# Altium project fm_transmitter.PrjPcb
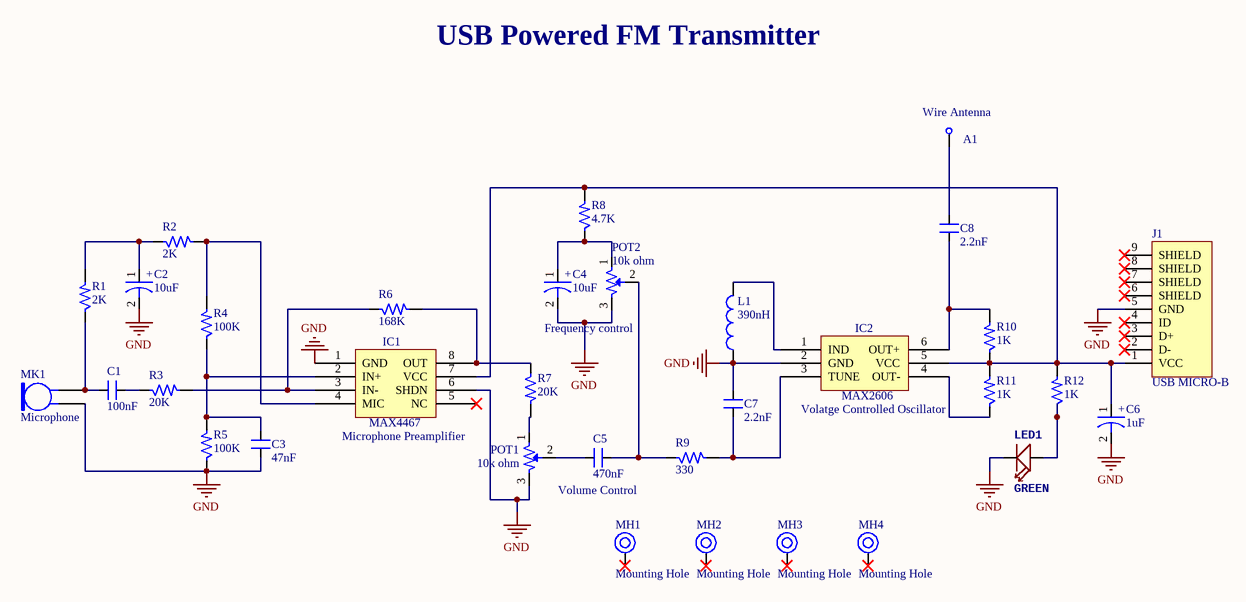
[diagram p0: fm_transmitter.SchDoc]
1 sheet, 33 parts. Net scope: global (net labels, ports and power ports of the same name join across sheets).
Board file: fm_transmitter.PcbDoc

## Sheet fm_transmitter.SchDoc
size A4; PageSetup: Record=PageOptions¦CenterHorizontal=False¦CenterVertical=False¦PrintScale=0.95¦XCorrection=0.00¦YCorrection=0.00¦PrintKind=1¦BorderSize=5000000¦LeftOffset=0¦BottomOffset=0¦Orientation=1¦PaperLength=1000¦PaperWidth=1000¦Scale=100¦PaperSource=15¦PrintQuality=600¦MediaType=1¦DitherType=10¦PaperKind=A4¦PrintScaleMode=1; ProcessInspection: Ò.êîíòð.; NormInspection: Í.êîíòð.; Letter1Column: {}; Letter2Column: {}; Letter3Column: {}; AgreedBy: Ñîãëàñîâàë

### Parts
A1  Wire Antenna  [TEST POINT_78]
C1  100nF  [CAP_0805]
C2  10uF  [ACAP_P339_D393_H531_RAD]
C3  47nF  [CAP_0805]
C4  10uF  [ACAP_P339_D393_H531_RAD]
C5  470nF  [CAP_0805]
C6  1uF  [ACAP_P339_D393_H531_RAD]
C7  2.2nF  [CAP_0805]
C8  2.2nF  [CAP_0805]
IC1  MAX4467  [TI SOT-23-8 DDF]
IC2  MAX2606  [MAXIM SOT-23-6]
J1  USB MICRO-B  [CON_10118192-0001LF_SMD]
L1  390nH  [IND_0805]
LED1  GREEN  [LED-0603]
MH1  Mounting Hole  [MOUNTING]
MH2  Mounting Hole  [MOUNTING]
MH3  Mounting Hole  [MOUNTING]
MH4  Mounting Hole  [MOUNTING]
MK1  Microphone  [PIN2]
POT1  10k ohm  [POT_3361P_SMD]
POT2  10k ohm  [POT_3361P_SMD]
R1  2K  [RES_0805]
R2  2K  [RES_0805]
R3  20K  [RES_0805]
R4  100K  [RES_0805]
R5  100K  [RES_0805]
R6  168K  [RES_0805]
R7  20K  [RES_0805]
R8  4.7K  [RES_0805]
R9  330  [RES_0805]
R10  1K  [RES_0805]
R11  1K  [RES_0805]
R12  1K  [RES_0805]

### Nets
GND: C2.2 C3.1 C4.2 C6.2 C7.2 IC1.1(GND) IC1.6(SHDN) IC2.2(GND) J1.5(GND) L1.1 LED1.- MK1.1 POT1.3 POT2.3 R5.1
NetA1_1: A1.1 C8.2
NetC1_1: C1.1 MK1.2 R1.1
NetC1_2: C1.2 R3.1
NetC2_1: C2.1 R1.2 R2.1
NetC3_2: C3.2 IC1.2(IN+) R4.1 R5.2
NetC4_1: C4.1 POT2.1 R8.1
NetC5_1: C5.1 POT1.2
NetC5_2: C5.2 POT2.2 R9.1
NetC6_1: C6.1 IC1.7(VCC) IC2.5(VCC) J1.1(VCC) R8.2 R10.1 R11.2 R12.2
NetC7_1: C7.1 IC2.3(TUNE) R9.2
NetC8_1: C8.1 IC2.6(OUT+) R10.2
NetIC1_3: IC1.3(IN-) R3.2 R6.1
NetIC1_4: IC1.4(MIC) R2.2 R4.2
NetIC1_8: IC1.8(OUT) R6.2 R7.1
NetIC2_1: IC2.1(IND) L1.2
NetIC2_4: IC2.4(OUT-) R11.1
NetLED1_+: LED1.+ R12.1
NetPOT1_1: POT1.1 R7.2

Not connected (* = marked no-connect by the designer): IC1 5(NC)*; J1 2(D-)* 3(D+)* 4(ID)* 6(SHIELD)* 7(SHIELD)* 8(SHIELD)* 9(SHIELD)*; MH1 1*; MH2 1*; MH3 1*; MH4 1*

### Notes on the sheet
- USB Powered FM Transmitter
- Frequency control
- (near R11) Volatge Controlled Oscillator
- (near IC1) Microphone Preamplifier
- Volume Control
- Title
- Size:
- Date:
- A4
- Number:
- Time:
- Revision:
- Sheet
- of
- File:
- (in symbol CAP-P_10uF-400V-20%-RAD) +

### Library data of the parts
A1 = TEST POINT: 0.4mm hole size Test point; Manufacturer Part Number: NA; Case/Package: TH; Manufacturer: NA; Supplier-1: NA; Supplier Part Number-1: NA; Alternate Part Number-1: NA
C1 C3 C5 C7 C8 = CAP_0.1uF-50V-10%-0805: 0.1µF ±10% 50V Ceramic Capacitor X7R 0805 (2012 Metric) /; Manufacturer: Samsung; Manufacturer Part Number: CL21B104KBCNNNC; Alternate Part Number-1: NA; Case/Package: 0805; Supplier-1: SIRICOM; Supplier Part Number-1: 0805B104K500CT
C2 C4 C6 = CAP-P_10uF-400V-20%-RAD: 10µF 400V Aluminum Electrolytic Capacitors Radial, Can - SMD 10000 Hrs @ 105°C /; Manufacturer: Nichicon; Manufacturer Part Number: ULV2G100MNL1GS; Alternate Part Number-1: NA; Case/Package: Radial-SMD; Supplier-1: SP ROAD; Supplier Part Number-1: ULV2G100MNL1GS
IC1 = IC_MAX4467: ComponentLink1Description: Datasheet; ComponentLink1URL: https://datasheets.maximintegrated.com/en/ds/MAX4465-MAX4469.pdf
IC2 = IC_MAX2606: ComponentLink1Description: Datasheet; ComponentLink1URL: https://datasheets.maximintegrated.com/en/ds/MAX2605-MAX2609.pdf
J1 = CON_USB2.0_MICROB-SMD: USB - micro B USB 2.0 Receptacle Connector 5 Position Surface Mount, Right Angle; Manufacturer: ICC; Manufacturer Part Number: 10118192-0001LF; Alternate Part Number-1: NA; Case/Package: USB MICRO-B SMD; Supplier-1: SUNROM; Supplier Part Number-1: MICRO USB
L1 = IND_33uH-8A-20%-SMD: Fixed Inductors MSS1583 SMT Power 0.038Ohms 33uH; Manufacturer: Coilcraft; Manufacturer Part Number: MSS1583-333MEB; Alternate Part Number-1: NA; Case/Package: SMD; Supplier-1: COILCRAFT SAMPLE; Supplier Part Number-1: MSS1583-333MEB
LED1 = LED-SMD-RED-DIFFUSED(0603): MPN: 19-217-R6C-AL1M2VY-3T
MH1-MH4 = MH_3.5H_6D: Manufacturer Part Number: NA; Case/Package: TH; Manufacturer: NA; Supplier-1: NA; Supplier Part Number-1: NA; Alternate Part Number-1: NA
MK1 = Mic2: Published: 24-Mar-1999; LatestRevisionDate: 17-Jul-2002; LatestRevisionNote: Re-released for DXP Platform.; PackageReference: PIN2; Publisher: Altium Limited
POT1 POT2 = POT_10K-3361P-1-103GLF-SMD: 10 kOhms 0.5W, 1/2W Gull Wing Surface Mount Trimmer Potentiometer Cermet 1 Turn Top Adjustment; Manufacturer: Bourns; Alternate Part Number-1: NA; Manufacturer Part Number: 3361P-1-103GLF; Case/Package: SMD; Supplier-1: Mouser; Supplier Part Number-1: 652-3361P-1-103GLF
R1 R2 = RES_2K-0.125W-1%-0805: 2 kOhms ±1% 0.125W, 1/8W Chip Resistor 0805 (2012 Metric) Moisture Resistant Thick Film /; Manufacturer: TE Connectivity; Manufacturer Part Number: RC0805FR-072KL; Alternate Part Number-1: NA; Case/Package: 0805; Supplier-1: SIRICOM; Supplier Part Number-1: WR08X2001FTL
R3 R7 = RES_20K-0.5W-5%-0805: 20 kOhms ±5% 0.5W, 1/2W Chip Resistor 0805 (2012 Metric) Automotive AEC-Q200, Pulse Withstanding Thick Film /; Manufacturer: Panasonic; Manufacturer Part Number: ERJ-P06J203V; Alternate Part Number-1: NA; Case/Package: 0805; Supplier-1: SIRICOM; Supplier Part Number-1: WR08X2002FTL
R4 R5 = RES_100K-0.125W-1%-0805: 100 kOhms ±1% 0.125W, 1/8W Chip Resistor 0805 (2012 Metric) Automotive AEC-Q200 Thick Film /; Manufacturer: Walsin; Manufacturer Part Number: WR08X1003FTL; Alternate Part Number-1: NA; Case/Package: 0805; Supplier-1: SIRICOM; Supplier Part Number-1: WR08X1003FTL
R6 = RES_100K-0.125W-1%-0805: 168 kOhms ±1% 0.125W, 1/8W Chip Resistor 0805 (2012 Metric) Automotive AEC-Q200 Thick Film /; Manufacturer: Walsin; Manufacturer Part Number: WR08X1003FTL; Alternate Part Number-1: NA; Case/Package: 0805; Supplier-1: SIRICOM; Supplier Part Number-1: WR08X1003FTL
R8 = RES_4.7K-0.125W-1%-0805: 4.7 kOhms ±1% 0.125W, 1/8W Chip Resistor 0805 (2012 Metric) Moisture Resistant Thick Film /; Manufacturer: TE Connectivity; Manufacturer Part Number: RC0805FR-074K7L; Alternate Part Number-1: 0805W8F4701T5E; Case/Package: 0805; Supplier-1: SIRICOM; Supplier Part Number-1: WR08X4701FTL
R9 = RES_3.3K-0.125W-1%-0805: 300 Ohms ±1% 0.125W, 1/8W Chip Resistor 0805 (2012 Metric) Thick Film /; Manufacturer: Panasonic; Manufacturer Part Number: 1623214-1; Alternate Part Number-1: 0805W8F3301T5E; Case/Package: 0805; Supplier-1: SIRICOM; Supplier Part Number-1: WR08X3301FTL
R10 R12 = RES_1K-0.125W-1%-0805: 1 kOhms ±1% 0.125W, 1/8W Chip Resistor 0805 (2012 Metric) Moisture Resistant Thick Film /; Manufacturer: Walsin; Manufacturer Part Number: WR08X1001FTL; Case/Package: 0805; Supplier-1: SP ROAD; Supplier Part Number-1: RC0805JR-071KL; Alternate Part Number-1: WR08X1001FTL
R11 = RES_10K-0.125W-1%-0805: 10 kOhms ±1% 0.125W, 1/8W Chip Resistor 0805 (2012 Metric) Automotive AEC-Q200 Thick Film /; Manufacturer: CTS; Manufacturer Part Number: WR08X1002FTL; Case/Package: 0805; Supplier-1: SIRICOM; Supplier Part Number-1: WR08X1002FTL; Alternate Part Number-1: WR08X1002FTL